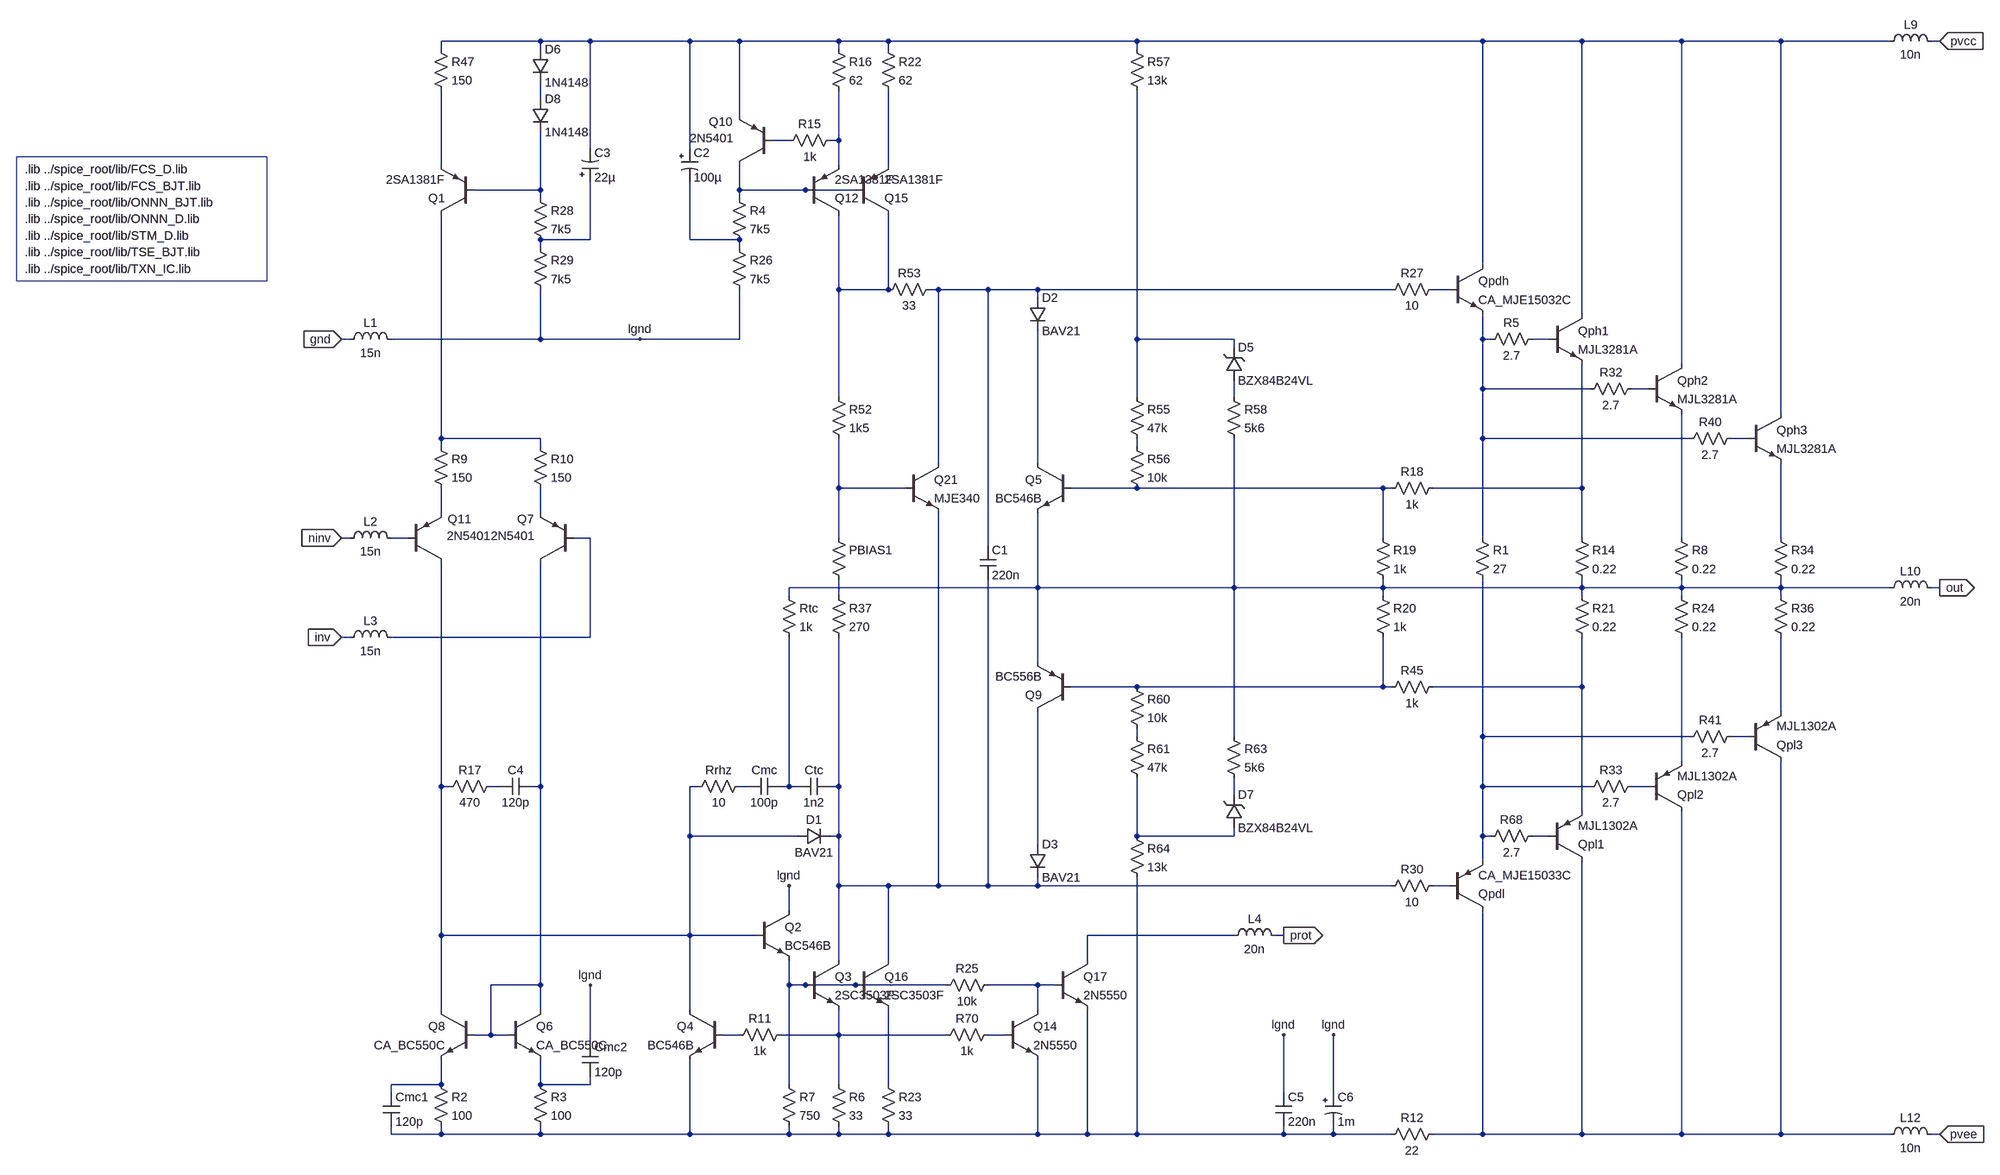
[diagram p0: schematic pab3bbb-arguo-module.asc]
pab3bbb-arguo-module.asc, the LTspice schematic file:
Version 4
SHEET 1 6124 2336
WIRE -192 -1280 -384 -1280
WIRE -96 -1280 -192 -1280
WIRE 96 -1280 -96 -1280
WIRE 192 -1280 96 -1280
WIRE 384 -1280 192 -1280
WIRE 480 -1280 384 -1280
WIRE 960 -1280 480 -1280
WIRE 1632 -1280 960 -1280
WIRE 1824 -1280 1632 -1280
WIRE 2016 -1280 1824 -1280
WIRE 2208 -1280 2016 -1280
WIRE 2592 -1280 2208 -1280
WIRE 2688 -1280 2672 -1280
WIRE -384 -1264 -384 -1280
WIRE -192 -1264 -192 -1280
WIRE 384 -1264 384 -1280
WIRE 480 -1264 480 -1280
WIRE 960 -1264 960 -1280
WIRE -192 -1168 -192 -1200
WIRE 192 -1136 192 -1280
WIRE 288 -1088 256 -1088
WIRE 384 -1088 384 -1184
WIRE 384 -1088 368 -1088
WIRE -96 -1072 -96 -1280
WIRE 96 -1072 96 -1280
WIRE -384 -1040 -384 -1184
WIRE 384 -1040 384 -1088
WIRE 480 -1040 480 -1184
WIRE -192 -992 -192 -1104
WIRE -192 -992 -320 -992
WIRE 192 -992 192 -1040
WIRE 320 -992 192 -992
WIRE 416 -992 320 -992
WIRE -192 -976 -192 -992
WIRE 192 -976 192 -992
WIRE -96 -896 -96 -1008
WIRE -96 -896 -192 -896
WIRE 96 -896 96 -1008
WIRE 192 -896 96 -896
WIRE -192 -880 -192 -896
WIRE 192 -880 192 -896
WIRE 1632 -848 1632 -1280
WIRE 384 -800 384 -944
WIRE 480 -800 480 -944
WIRE 480 -800 384 -800
WIRE 576 -800 560 -800
WIRE 672 -800 576 -800
WIRE 768 -800 672 -800
WIRE 1456 -800 768 -800
WIRE 1568 -800 1536 -800
WIRE 768 -784 768 -800
WIRE 1824 -752 1824 -1280
WIRE -560 -704 -576 -704
WIRE -192 -704 -192 -800
WIRE -192 -704 -480 -704
WIRE 0 -704 -192 -704
WIRE 192 -704 192 -800
WIRE 192 -704 0 -704
WIRE 960 -704 960 -1184
WIRE 1152 -704 960 -704
WIRE 1632 -704 1632 -752
WIRE 1648 -704 1632 -704
WIRE 1760 -704 1728 -704
WIRE 1152 -688 1152 -704
WIRE 2016 -656 2016 -1280
WIRE 1632 -608 1632 -704
WIRE 1840 -608 1632 -608
WIRE 1952 -608 1920 -608
WIRE 384 -592 384 -800
WIRE 960 -592 960 -704
WIRE 1152 -592 1152 -624
WIRE 2208 -560 2208 -1280
WIRE -384 -512 -384 -944
WIRE -192 -512 -384 -512
WIRE 1632 -512 1632 -608
WIRE 2032 -512 1632 -512
WIRE 2144 -512 2112 -512
WIRE -384 -496 -384 -512
WIRE -192 -496 -192 -512
WIRE 960 -496 960 -512
WIRE 576 -464 576 -800
WIRE 768 -464 768 -720
WIRE 384 -416 384 -512
WIRE 512 -416 384 -416
WIRE 960 -416 832 -416
WIRE 1440 -416 960 -416
WIRE 1456 -416 1440 -416
WIRE 1824 -416 1824 -656
WIRE 1824 -416 1536 -416
WIRE -384 -368 -384 -416
WIRE -192 -368 -192 -416
WIRE -560 -320 -576 -320
WIRE -448 -320 -480 -320
WIRE -96 -320 -128 -320
WIRE 384 -320 384 -416
WIRE 1440 -320 1440 -416
WIRE 1632 -320 1632 -512
WIRE 1824 -320 1824 -416
WIRE 2016 -320 2016 -560
WIRE 2208 -320 2208 -464
WIRE 672 -304 672 -800
WIRE 768 -224 768 -368
WIRE 768 -224 288 -224
WIRE 1152 -224 1152 -512
WIRE 1152 -224 768 -224
WIRE 1440 -224 1440 -240
WIRE 1440 -224 1152 -224
WIRE 1824 -224 1824 -240
WIRE 1824 -224 1440 -224
WIRE 2016 -224 2016 -240
WIRE 2016 -224 1824 -224
WIRE 2208 -224 2208 -240
WIRE 2208 -224 2016 -224
WIRE 2592 -224 2208 -224
WIRE 2688 -224 2672 -224
WIRE 288 -208 288 -224
WIRE 384 -208 384 -240
WIRE 1440 -208 1440 -224
WIRE 1824 -208 1824 -224
WIRE 2016 -208 2016 -224
WIRE 2208 -208 2208 -224
WIRE -560 -128 -576 -128
WIRE -96 -128 -96 -320
WIRE -96 -128 -480 -128
WIRE 768 -80 768 -224
WIRE 960 -32 832 -32
WIRE 1440 -32 1440 -128
WIRE 1440 -32 960 -32
WIRE 1456 -32 1440 -32
WIRE 1824 -32 1824 -128
WIRE 1824 -32 1536 -32
WIRE 2208 16 2208 -128
WIRE 960 64 960 48
WIRE 1152 64 1152 -224
WIRE 1632 64 1632 -240
WIRE 2032 64 1632 64
WIRE 2144 64 2112 64
WIRE 2016 112 2016 -128
WIRE -384 160 -384 -272
WIRE -368 160 -384 160
WIRE -272 160 -288 160
WIRE -192 160 -192 -272
WIRE -192 160 -208 160
WIRE 112 160 96 160
WIRE 208 160 192 160
WIRE 288 160 288 -128
WIRE 288 160 272 160
WIRE 304 160 288 160
WIRE 384 160 384 -128
WIRE 384 160 368 160
WIRE 1632 160 1632 64
WIRE 1840 160 1632 160
WIRE 1952 160 1920 160
WIRE 1152 176 1152 144
WIRE 1824 208 1824 -32
WIRE 96 256 96 160
WIRE 304 256 96 256
WIRE 384 256 384 160
WIRE 384 256 368 256
WIRE 960 256 960 144
WIRE 1152 256 1152 240
WIRE 1152 256 960 256
WIRE 1632 256 1632 160
WIRE 1648 256 1632 256
WIRE 1760 256 1728 256
WIRE 768 272 768 16
WIRE 1632 304 1632 256
WIRE 384 352 384 256
WIRE 480 352 384 352
WIRE 576 352 576 -368
WIRE 576 352 480 352
WIRE 672 352 672 -240
WIRE 672 352 576 352
WIRE 768 352 768 336
WIRE 768 352 672 352
WIRE 1456 352 768 352
WIRE 1568 352 1536 352
WIRE 288 400 288 352
WIRE -384 448 -384 160
WIRE 96 448 96 256
WIRE 96 448 -384 448
WIRE 224 448 96 448
WIRE 1152 448 864 448
WIRE 1248 448 1232 448
WIRE 384 496 384 352
WIRE 480 496 480 352
WIRE 864 496 864 448
WIRE -192 544 -192 160
WIRE -192 544 -288 544
WIRE 288 544 288 496
WIRE 320 544 288 544
WIRE 416 544 320 544
WIRE 592 544 416 544
WIRE 768 544 672 544
WIRE 800 544 768 544
WIRE -384 592 -384 448
WIRE -192 592 -192 544
WIRE 96 592 96 448
WIRE 768 592 768 544
WIRE -288 640 -288 544
WIRE -288 640 -320 640
WIRE -256 640 -288 640
WIRE 192 640 160 640
WIRE 384 640 384 592
WIRE 384 640 272 640
WIRE 592 640 384 640
WIRE 704 640 672 640
WIRE -96 656 -96 544
WIRE -384 736 -384 688
WIRE -384 736 -480 736
WIRE -192 736 -192 688
WIRE -96 736 -96 720
WIRE -96 736 -192 736
WIRE 288 736 288 544
WIRE 384 736 384 640
WIRE 480 736 480 592
WIRE -480 752 -480 736
WIRE 1248 752 1248 640
WIRE 1344 752 1344 640
WIRE -480 832 -480 816
WIRE -384 832 -384 816
WIRE -384 832 -480 832
WIRE -192 832 -192 816
WIRE -192 832 -384 832
WIRE 96 832 96 688
WIRE 96 832 -192 832
WIRE 288 832 288 816
WIRE 288 832 96 832
WIRE 384 832 384 816
WIRE 384 832 288 832
WIRE 480 832 480 816
WIRE 480 832 384 832
WIRE 768 832 768 688
WIRE 768 832 480 832
WIRE 864 832 864 592
WIRE 864 832 768 832
WIRE 960 832 960 336
WIRE 960 832 864 832
WIRE 1248 832 1248 816
WIRE 1248 832 960 832
WIRE 1344 832 1344 816
WIRE 1344 832 1248 832
WIRE 1456 832 1344 832
WIRE 1632 832 1632 400
WIRE 1632 832 1536 832
WIRE 1824 832 1824 304
WIRE 1824 832 1632 832
WIRE 2016 832 2016 208
WIRE 2016 832 1824 832
WIRE 2208 832 2208 112
WIRE 2208 832 2016 832
WIRE 2592 832 2208 832
WIRE 2688 832 2672 832
FLAG 2688 -1280 pvcc
IOPIN 2688 -1280 In
FLAG 2688 832 pvee
IOPIN 2688 832 In
FLAG 2688 -224 out
IOPIN 2688 -224 Out
FLAG -576 -320 ninv
IOPIN -576 -320 In
FLAG -576 -128 inv
IOPIN -576 -128 In
FLAG -576 -704 gnd
IOPIN -576 -704 In
FLAG 0 -704 lgnd
FLAG 288 352 lgnd
FLAG -96 544 lgnd
FLAG 1248 448 prot
IOPIN 1248 448 Out
FLAG 1248 640 lgnd
FLAG 1344 640 lgnd
SYMBOL pnp -448 -272 M180
WINDOW 0 77 84 Left 2
WINDOW 3 75 52 Left 2
SYMATTR InstName Q11
SYMATTR Value 2N5401
SYMBOL res -400 720 R0
SYMATTR InstName R2
SYMATTR Value 100
SYMBOL res -208 720 R0
SYMATTR InstName R3
SYMATTR Value 100
SYMBOL res -400 -512 R0
SYMATTR InstName R9
SYMATTR Value 150
SYMBOL res -208 -512 R0
SYMATTR InstName R10
SYMATTR Value 150
SYMBOL res 368 -1280 R0
SYMATTR InstName R16
SYMATTR Value 62
SYMBOL pnp 320 -944 M180
SYMATTR InstName Q12
SYMATTR Value 2SA1381F
SYMBOL res 1552 -816 R90
WINDOW 0 0 56 VBottom 2
WINDOW 3 32 56 VTop 2
SYMATTR InstName R27
SYMATTR Value 10
SYMBOL res 1552 336 R90
WINDOW 0 0 56 VBottom 2
WINDOW 3 32 56 VTop 2
SYMATTR InstName R30
SYMATTR Value 10
SYMBOL res -400 -1280 R0
SYMATTR InstName R47
SYMATTR Value 150
SYMBOL res 368 -336 R0
WINDOW 3 36 76 Invisible 2
SYMATTR Value {1+(500*BIAS)}
SYMATTR InstName PBIAS1
SYMBOL res 368 -608 R0
SYMATTR InstName R52
SYMATTR Value 1k5
SYMBOL res 576 -816 R90
WINDOW 0 0 56 VBottom 2
WINDOW 3 32 56 VTop 2
SYMATTR InstName R53
SYMATTR Value 33
SYMBOL npn 320 496 R0
SYMATTR InstName Q3
SYMATTR Value 2SC3503F
SYMBOL res 368 720 R0
SYMATTR InstName R6
SYMATTR Value 33
SYMBOL res 176 -992 R0
SYMATTR InstName R4
SYMATTR Value 7k5
SYMBOL pnp -320 -944 R180
SYMATTR InstName Q1
SYMATTR Value 2SA1381F
SYMBOL pnp -128 -272 R180
WINDOW 0 77 84 Left 2
WINDOW 3 75 52 Left 2
SYMATTR InstName Q7
SYMATTR Value 2N5401
SYMBOL npn 512 -464 R0
SYMATTR InstName Q21
SYMATTR Value MJE340
SYMBOL res 368 -224 R0
SYMATTR InstName R37
SYMATTR Value 270
SYMBOL npn 1760 -752 R0
SYMATTR InstName Qph1
SYMATTR Value MJL3281A
SYMBOL pnp 1760 304 M180
SYMATTR InstName Qpl1
SYMATTR Value MJL1302A
SYMBOL res 1744 -720 R90
WINDOW 0 0 56 VBottom 2
WINDOW 3 32 56 VTop 2
SYMATTR InstName R5
SYMATTR Value 2.7
SYMBOL res 1744 240 R90
WINDOW 0 0 56 VBottom 2
WINDOW 3 32 56 VTop 2
SYMATTR InstName R68
SYMATTR Value 2.7
SYMBOL cap 272 144 R90
WINDOW 0 0 32 VBottom 2
WINDOW 3 32 32 VTop 2
SYMATTR InstName Cmc
SYMATTR Value 100p
SYMATTR SpiceLine V=100 Irms=20.8m Rser=5.448 Lser=3n Rpar=6.4meg Cpar=1p
SYMBOL npn -256 592 R0
SYMATTR InstName Q6
SYMATTR Value CA_BC550C
SYMBOL npn -320 592 M0
SYMATTR InstName Q8
SYMATTR Value CA_BC550C
SYMBOL res 384 -1104 R90
WINDOW 0 0 56 VBottom 2
WINDOW 3 32 56 VTop 2
SYMATTR InstName R15
SYMATTR Value 1k
SYMBOL npn 224 400 R0
SYMATTR InstName Q2
SYMATTR Value BC546B
SYMBOL res 272 720 R0
SYMATTR InstName R7
SYMATTR Value 750
SYMBOL cap 368 144 R90
WINDOW 0 0 32 VBottom 2
WINDOW 3 32 32 VTop 2
SYMATTR InstName Ctc
SYMATTR Value 1n2
SYMATTR SpiceLine V=100 Irms=75.3m Rser=2.89088 Lser=3n Rpar=4.4meg Cpar=1p
SYMBOL res 272 -224 R0
SYMATTR InstName Rtc
SYMATTR Value 1k
SYMBOL diode 304 272 R270
WINDOW 0 32 32 VTop 2
WINDOW 3 0 32 VBottom 2
SYMATTR InstName D1
SYMATTR Value BAV21
SYMBOL pnp 256 -1040 R180
WINDOW 0 77 84 Left 2
WINDOW 3 75 52 Left 2
SYMATTR InstName Q10
SYMATTR Value 2N5401
SYMBOL res 1808 -336 R0
SYMATTR InstName R14
SYMATTR Value 0.22
SYMBOL res 1808 -224 R0
SYMATTR InstName R21
SYMATTR Value 0.22
SYMBOL cap 656 -240 M180
WINDOW 0 24 56 Left 2
WINDOW 3 24 8 Left 2
SYMATTR InstName C1
SYMATTR Value 220n
SYMATTR SpiceLine V=25 Irms=1.76 Rser=0.057522 Lser=3n Rpar=4.4meg Cpar=1p
SYMBOL ind -576 -688 R270
WINDOW 0 32 56 VTop 2
WINDOW 3 5 56 VBottom 2
SYMATTR InstName L1
SYMATTR Value 15n
SYMATTR SpiceLine Rser=20m
SYMBOL ind -576 -304 R270
WINDOW 0 32 56 VTop 2
WINDOW 3 5 56 VBottom 2
SYMATTR InstName L2
SYMATTR Value 15n
SYMATTR SpiceLine Rser=20m
SYMBOL ind -576 -112 R270
WINDOW 0 32 56 VTop 2
WINDOW 3 5 56 VBottom 2
SYMATTR InstName L3
SYMATTR Value 15n
SYMATTR SpiceLine Rser=20m
SYMBOL ind 2576 -208 R270
WINDOW 0 32 56 VTop 2
WINDOW 3 5 56 VBottom 2
SYMATTR InstName L10
SYMATTR Value 20n
SYMATTR SpiceLine Rser=10m
SYMBOL ind 2576 -1264 R270
WINDOW 0 32 56 VTop 2
WINDOW 3 5 56 VBottom 2
SYMATTR InstName L9
SYMATTR Value 10n
SYMATTR SpiceLine Rser=10m
SYMBOL ind 2576 848 R270
WINDOW 0 32 56 VTop 2
WINDOW 3 5 56 VBottom 2
SYMATTR InstName L12
SYMATTR Value 10n
SYMATTR SpiceLine Rser=10m
SYMBOL cap -272 176 R270
WINDOW 0 32 32 VTop 2
WINDOW 3 0 32 VBottom 2
SYMATTR InstName C4
SYMATTR Value 120p
SYMATTR SpiceLine V=100 Irms=20.8m Rser=15.448 Lser=3n Rpar=6.4meg Cpar=1p
SYMBOL res -272 144 R90
WINDOW 0 0 56 VBottom 2
WINDOW 3 32 56 VTop 2
SYMATTR InstName R17
SYMATTR Value 470
SYMBOL npn 1568 -848 R0
SYMATTR InstName Qpdh
SYMATTR Value CA_MJE15032C
SYMBOL pnp 1568 400 M180
SYMATTR InstName Qpdl
SYMATTR Value CA_MJE15033C
SYMBOL res 1616 -336 R0
SYMATTR InstName R1
SYMATTR Value 27
SYMBOL res 208 144 R90
WINDOW 0 0 56 VBottom 2
WINDOW 3 32 56 VTop 2
SYMATTR InstName Rrhz
SYMATTR Value 10
SYMBOL res 2000 -336 R0
SYMATTR InstName R8
SYMATTR Value 0.22
SYMBOL res 2000 -224 R0
SYMATTR InstName R24
SYMATTR Value 0.22
SYMBOL npn 1952 -656 R0
SYMATTR InstName Qph2
SYMATTR Value MJL3281A
SYMBOL res 1936 -624 R90
WINDOW 0 0 56 VBottom 2
WINDOW 3 32 56 VTop 2
SYMATTR InstName R32
SYMATTR Value 2.7
SYMBOL pnp 1952 208 M180
SYMATTR InstName Qpl2
SYMATTR Value MJL1302A
SYMBOL res 1936 144 R90
WINDOW 0 0 56 VBottom 2
WINDOW 3 32 56 VTop 2
SYMATTR InstName R33
SYMATTR Value 2.7
SYMBOL res 2192 -336 R0
SYMATTR InstName R34
SYMATTR Value 0.22
SYMBOL res 2192 -224 R0
SYMATTR InstName R36
SYMATTR Value 0.22
SYMBOL res 2128 -528 R90
WINDOW 0 0 56 VBottom 2
WINDOW 3 32 56 VTop 2
SYMATTR InstName R40
SYMATTR Value 2.7
SYMBOL res 2128 48 R90
WINDOW 0 0 56 VBottom 2
WINDOW 3 32 56 VTop 2
SYMATTR InstName R41
SYMATTR Value 2.7
SYMBOL ind 1136 464 R270
WINDOW 0 32 56 VTop 2
WINDOW 3 5 56 VBottom 2
SYMATTR InstName L4
SYMATTR Value 20n
SYMATTR SpiceLine Rser=10m
SYMBOL npn 160 592 M0
SYMATTR InstName Q4
SYMATTR Value BC546B
SYMBOL res 288 624 R90
WINDOW 0 0 56 VBottom 2
WINDOW 3 32 56 VTop 2
SYMATTR InstName R11
SYMATTR Value 1k
SYMBOL npn 832 -464 M0
SYMATTR InstName Q5
SYMATTR Value BC546B
SYMBOL res 1552 -432 R90
WINDOW 0 0 56 VBottom 2
WINDOW 3 32 56 VTop 2
SYMATTR InstName R18
SYMATTR Value 1k
SYMBOL res 1424 -336 R0
SYMATTR InstName R19
SYMATTR Value 1k
SYMBOL diode 752 -784 R0
SYMATTR InstName D2
SYMATTR Value BAV21
SYMBOL pnp 832 16 R180
SYMATTR InstName Q9
SYMATTR Value BC556B
SYMBOL res 1424 -224 R0
SYMATTR InstName R20
SYMATTR Value 1k
SYMBOL res 1552 -48 R90
WINDOW 0 0 56 VBottom 2
WINDOW 3 32 56 VTop 2
SYMATTR InstName R45
SYMATTR Value 1k
SYMBOL diode 752 272 R0
SYMATTR InstName D3
SYMATTR Value BAV21
SYMBOL res 944 -608 R0
SYMATTR InstName R55
SYMATTR Value 47k
SYMBOL res 944 -512 R0
SYMATTR InstName R56
SYMATTR Value 10k
SYMBOL res 944 -1280 R0
SYMATTR InstName R57
SYMATTR Value 13k
SYMBOL zener 1136 -624 M180
WINDOW 0 24 64 Left 2
WINDOW 3 24 0 Left 2
SYMATTR InstName D5
SYMATTR Value BZX84B24VL
SYMATTR Description Diode
SYMATTR Type diode
SYMBOL res 1136 -608 R0
SYMATTR InstName R58
SYMATTR Value 5k6
SYMBOL res 944 -48 R0
SYMATTR InstName R60
SYMATTR Value 10k
SYMBOL res 944 48 R0
SYMATTR InstName R61
SYMATTR Value 47k
SYMBOL res 1136 48 R0
SYMATTR InstName R63
SYMATTR Value 5k6
SYMBOL zener 1136 240 M180
WINDOW 0 24 64 Left 2
WINDOW 3 24 0 Left 2
SYMATTR InstName D7
SYMATTR Value BZX84B24VL
SYMATTR Description Diode
SYMATTR Type diode
SYMBOL res 944 240 R0
SYMATTR InstName R64
SYMATTR Value 13k
SYMBOL npn 704 592 R0
SYMATTR InstName Q14
SYMATTR Value 2N5550
SYMBOL res 688 624 R90
WINDOW 0 0 56 VBottom 2
WINDOW 3 32 56 VTop 2
SYMATTR InstName R70
SYMATTR Value 1k
SYMBOL pnp 416 -944 M180
SYMATTR InstName Q15
SYMATTR Value 2SA1381F
SYMBOL npn 416 496 R0
SYMATTR InstName Q16
SYMATTR Value 2SC3503F
SYMBOL res 464 720 R0
SYMATTR InstName R23
SYMATTR Value 33
SYMBOL res 688 528 R90
WINDOW 0 0 56 VBottom 2
WINDOW 3 32 56 VTop 2
SYMATTR InstName R25
SYMATTR Value 10k
SYMBOL npn 800 496 R0
SYMATTR InstName Q17
SYMATTR Value 2N5550
SYMBOL polcap 80 -1072 R0
SYMATTR InstName C2
SYMATTR Value 100µ
SYMATTR SpiceLine V=50 Irms=580m Rser=0.16 Lser=0 Rpar=700k Cpar=1p mfg="Nichicon" pn="UPL1H101MPH6" type="Al electrolytic"
SYMATTR Description Capacitor
SYMATTR Type cap
SYMBOL polcap -112 -1008 M180
WINDOW 0 24 56 Left 2
WINDOW 3 24 8 Left 2
SYMATTR InstName C3
SYMATTR Value 22µ
SYMATTR SpiceLine V=35 Irms=65m Rser=2.3 Lser=0 Rpar=700k Cpar=1p mfg="Nichicon" pn="UPR1V220MAH" type="Al electrolytic"
SYMATTR Description Capacitor
SYMATTR Type cap
SYMBOL res 176 -896 R0
SYMATTR InstName R26
SYMATTR Value 7k5
SYMBOL res -208 -992 R0
SYMATTR InstName R28
SYMATTR Value 7k5
SYMBOL res -208 -896 R0
SYMATTR InstName R29
SYMATTR Value 7k5
SYMBOL diode -208 -1264 R0
SYMATTR InstName D6
SYMATTR Value 1N4148
SYMBOL diode -208 -1168 R0
SYMATTR InstName D8
SYMATTR Value 1N4148
SYMBOL res 1552 816 R90
WINDOW 0 0 56 VBottom 2
WINDOW 3 32 56 VTop 2
SYMATTR InstName R12
SYMATTR Value 22
SYMBOL cap 1232 816 M180
WINDOW 0 24 56 Left 2
WINDOW 3 24 8 Left 2
SYMATTR InstName C5
SYMATTR Value 220n
SYMATTR SpiceLine V=25 Irms=1.76 Rser=0.057522 Lser=3n Rpar=4.4meg Cpar=1p
SYMBOL polcap 1328 752 R0
SYMATTR InstName C6
SYMATTR Value 1m
SYMATTR SpiceLine V=63 Irms=1.7 Rser=0.042 Lser=0 Rpar=4.4meg Cpar=1p
SYMATTR Description Capacitor
SYMATTR Type cap
SYMBOL pnp 2144 112 M180
SYMATTR InstName Qpl3
SYMATTR Value MJL1302A
SYMBOL npn 2144 -560 R0
SYMATTR InstName Qph3
SYMATTR Value MJL3281A
SYMBOL res 464 -1280 R0
SYMATTR InstName R22
SYMATTR Value 62
SYMBOL cap -496 752 R0
SYMATTR InstName Cmc1
SYMATTR Value 120p
SYMATTR SpiceLine V=100 Irms=20.8m Rser=5.448 Lser=3n Rpar=6.4meg Cpar=1p
SYMBOL cap -112 656 R0
SYMATTR InstName Cmc2
SYMATTR Value 120p
SYMATTR SpiceLine V=100 Irms=20.8m Rser=5.448 Lser=3n Rpar=6.4meg Cpar=1p
TEXT -1376 -968 Left 2 !.lib ../spice_root/lib/ONNN_BJT.lib
TEXT -1376 -904 Left 2 !.lib ../spice_root/lib/STM_D.lib
TEXT -1376 -1000 Left 2 !.lib ../spice_root/lib/FCS_BJT.lib
TEXT -1376 -1032 Left 2 !.lib ../spice_root/lib/FCS_D.lib
TEXT -1376 -936 Left 2 !.lib ../spice_root/lib/ONNN_D.lib
TEXT -1376 -872 Left 2 !.lib ../spice_root/lib/TSE_BJT.lib
TEXT -1376 -840 Left 2 !.lib ../spice_root/lib/TXN_IC.lib
RECTANGLE Normal -720 -816 -1392 -1056

The netlist it stands for:
* pab3bbb-arguo-module.asc
Q11 N041 N028 N026 0 2N5401
R2 N059 N062 100
R3 N060 N062 100
R9 N019 N026 150
R10 N019 N027 150
R16 N001 N004 62
Q12 N011 N008 N004 0 2SA1381F
R27 N013 N012 10
R30 N052 N046 10
R47 N001 N005 150
R§PBIAS1 N023 N033 {1+(500*BIAS)}
R52 N011 N023 1k5
R53 N012 N011 33
Q3 N046 N054 N057 0 2SC3503F
R6 N057 N062 33
R4 N008 N010 7k5
Q1 N019 N007 N005 0 2SA1381F
Q7 N043 N029 N027 0 2N5401
Q21 N012 N023 N046 0 MJE340
R37 N033 N046 270
Qph1 N001 N016 N025 0 MJL3281A
Qpl1 N063 N050 N035 0 MJL1302A
R5 N016 N015 2.7
R68 N050 N038 2.7
Cmc N045 N044 100p V=100 Irms=20.8m Rser=5.448 Lser=3n Rpar=6.4meg Cpar=1p
Q6 N043 N043 N060 0 CA_BC550C
Q8 N041 N043 N059 0 CA_BC550C
R15 N004 N003 1k
Q2 lgnd N041 N054 0 BC546B
R7 N054 N062 750
Ctc N046 N045 1n2 V=100 Irms=75.3m Rser=2.89088 Lser=3n Rpar=4.4meg Cpar=1p
Rtc N032 N045 1k
D1 N041 N046 BAV21
Q10 N008 N003 N001 0 2N5401
R14 N025 N032 0.22
R21 N032 N035 0.22
C1 N046 N012 220n V=25 Irms=1.76 Rser=0.057522 Lser=3n Rpar=4.4meg Cpar=1p
L1 gnd lgnd 15n Rser=20m
L2 ninv N028 15n Rser=20m
L3 inv N029 15n Rser=20m
L10 N032 out 20n Rser=10m
L9 N001 pvcc 10n Rser=10m
L12 N063 pvee 10n Rser=10m
C4 N042 N043 120p V=100 Irms=20.8m Rser=15.448 Lser=3n Rpar=6.4meg Cpar=1p
R17 N042 N041 470
Qpdh N001 N013 N015 0 CA_MJE15032C
Qpdl N063 N052 N038 0 CA_MJE15033C
R1 N015 N038 27
Rrhz N044 N041 10
R8 N030 N032 0.22
R24 N032 N040 0.22
Qph2 N001 N017 N030 0 MJL3281A
R32 N017 N015 2.7
Qpl2 N063 N047 N040 0 MJL1302A
R33 N047 N038 2.7
R34 N031 N032 0.22
R36 N032 N036 0.22
R40 N020 N015 2.7
R41 N039 N038 2.7
L4 N053 prot 20n Rser=10m
Q4 N041 N056 N062 0 BC546B
R11 N057 N056 1k
Q5 N022 N024 N032 0 BC546B
R18 N025 N024 1k
R19 N024 N032 1k
D2 N012 N022 BAV21
Q9 N051 N034 N032 0 BC556B
R20 N032 N034 1k
R45 N035 N034 1k
D3 N051 N046 BAV21
R55 N014 N021 47k
R56 N021 N024 10k
R57 N001 N014 13k
D5 N018 N014 BZX84B24VL
R58 N018 N032 5k6
R60 N034 N037 10k
R61 N037 N049 47k
R63 N032 N048 5k6
D7 N049 N048 BZX84B24VL
R64 N049 N062 13k
Q14 N055 N058 N062 0 2N5550
R70 N058 N057 1k
Q15 N011 N008 N006 0 2SA1381F
Q16 N046 N054 N061 0 2SC3503F
R23 N061 N062 33
R25 N055 N054 10k
Q17 N053 N055 N062 0 2N5550
C2 N001 N010 100µ V=50 Irms=580m Rser=0.16 Lser=0 Rpar=700k Cpar=1p mfg="Nichicon" pn="UPL1H101MPH6" type="Al electrolytic"
C3 N009 N001 22µ V=35 Irms=65m Rser=2.3 Lser=0 Rpar=700k Cpar=1p mfg="Nichicon" pn="UPR1V220MAH" type="Al electrolytic"
R26 N010 lgnd 7k5
R28 N007 N009 7k5
R29 N009 lgnd 7k5
D6 N001 N002 1N4148
D8 N002 N007 1N4148
R12 N063 N062 22
C5 N062 lgnd 220n V=25 Irms=1.76 Rser=0.057522 Lser=3n Rpar=4.4meg Cpar=1p
C6 lgnd N062 1m V=63 Irms=1.7 Rser=0.042 Lser=0 Rpar=4.4meg Cpar=1p
Qpl3 N063 N039 N036 0 MJL1302A
Qph3 N001 N020 N031 0 MJL3281A
R22 N001 N006 62
Cmc1 N059 N062 120p V=100 Irms=20.8m Rser=5.448 Lser=3n Rpar=6.4meg Cpar=1p
Cmc2 lgnd N060 120p V=100 Irms=20.8m Rser=5.448 Lser=3n Rpar=6.4meg Cpar=1p
.model D D
.lib standard.dio
.model NPN NPN
.model PNP PNP
.lib standard.bjt
.lib ../spice_root/lib/ONNN_BJT.lib
.lib ../spice_root/lib/STM_D.lib
.lib ../spice_root/lib/FCS_BJT.lib
.lib ../spice_root/lib/FCS_D.lib
.lib ../spice_root/lib/ONNN_D.lib
.lib ../spice_root/lib/TSE_BJT.lib
.lib ../spice_root/lib/TXN_IC.lib
.backanno
.end